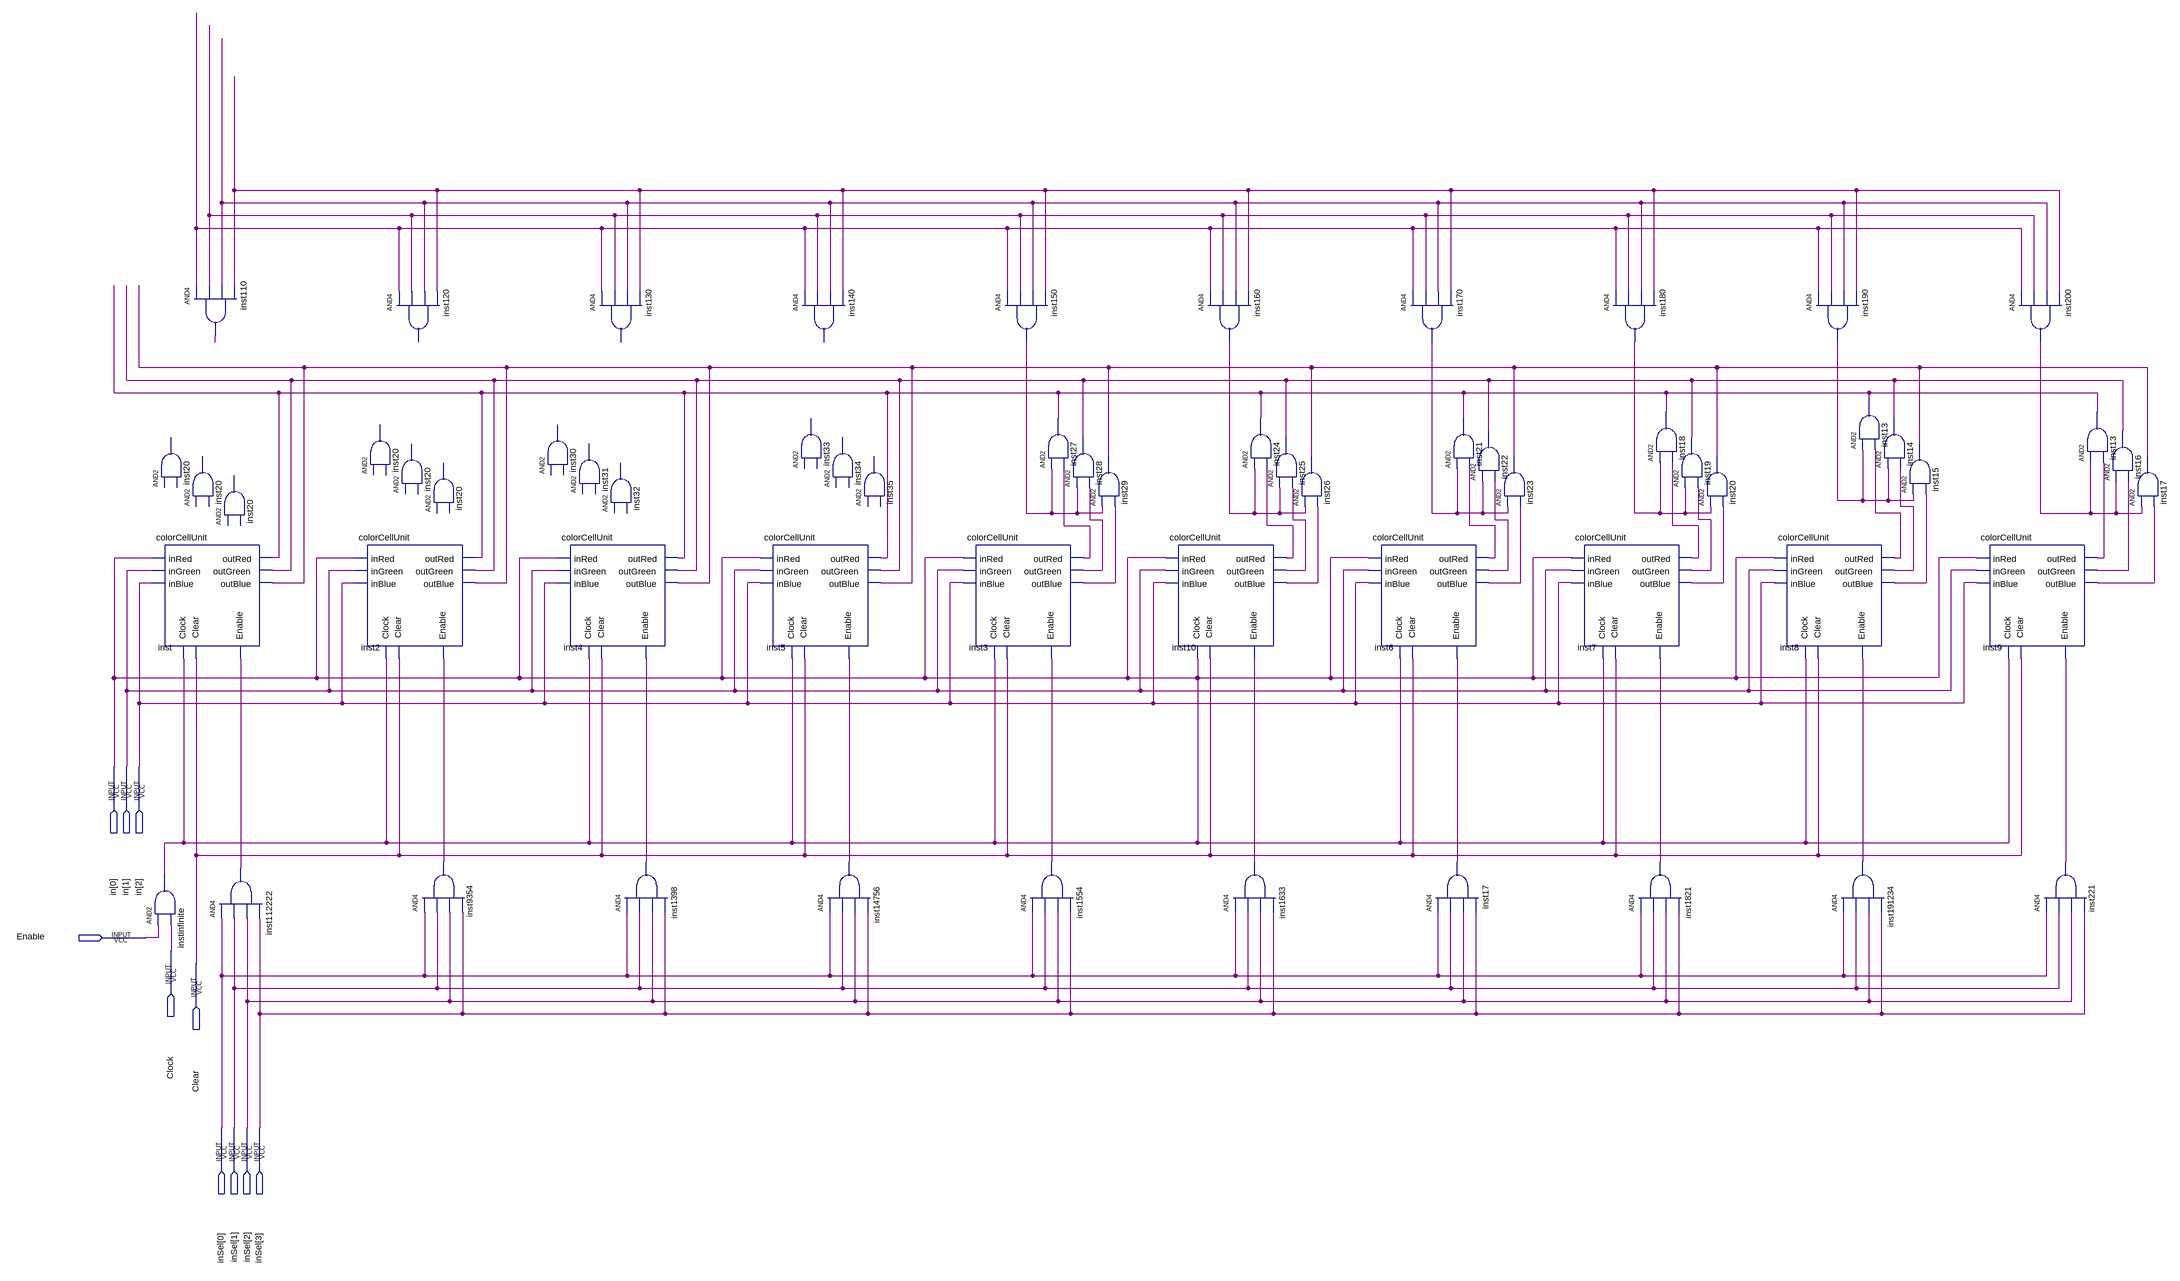
[diagram p0: schematic sheet]
// Quartus schematic colorCellRow.bdf as structural Verilog: 61 symbols, 10 pins
module colorCellRow (
  input  [2:0] in,
  input  Enable,
  input  Clock,
  input  Clear,
  input  [3:0] inSel
);

  wire inst3_outblue, inst3_outgreen, inst3_outred, inst6_outblue, inst6_outgreen, inst6_outred,
       inst7_outblue, inst7_outgreen, inst7_outred, inst8_outblue, inst8_outgreen, inst8_outred,
       inst9_outblue, inst9_outgreen, inst9_outred, inst10_outblue, inst10_outgreen, inst10_outred,
       inst17_out, inst110_out, inst150_out, inst160_out, inst170_out, inst180_out, inst190_out, inst200_out,
       inst221_out, inst1398_out, inst1554_out, inst1633_out, inst1821_out, inst9354_out, inst14756_out,
       inst112222_out, inst191234_out, inst_outblue, inst_outgreen, inst_outred, undriven, undriven_2,
       undriven_3, undriven_4;

  // AND2 inst20 is placed but not wired
  colorCellUnit inst (
    .inRed(in[0]), .inGreen(in[1]), .inBlue(in[2]), .Clock(in[0]), .Clear(Clear), .Enable(inst112222_out),
    .outRed(inst_outred), .outGreen(inst_outgreen), .outBlue(inst_outblue));
  and instinfinite (in[0], Enable, Clock);
  and inst110 (inst110_out, undriven_4, undriven, undriven_3, undriven_2);
  // AND2 inst20 is placed but not wired
  // AND2 inst20 is placed but not wired
  and inst112222 (inst112222_out, inSel[0], inSel[1], inSel[2], inSel[3]);
  // AND2 inst20 is placed but not wired
  colorCellUnit inst2 (
    .inRed(in[0]), .inGreen(in[1]), .inBlue(in[2]), .Clock(in[0]), .Clear(Clear), .Enable(inst9354_out),
    .outRed(inst_outred), .outGreen(inst_outgreen), .outBlue(inst_outblue));
  // AND4 inst120 has open pins: IN1=undriven_4, IN2=undriven, IN3=undriven_3, IN4=undriven_2, OUT=open
  // AND2 inst20 is placed but not wired
  and inst9354 (inst9354_out, inSel[0], inSel[1], inSel[2], inSel[3]);
  // AND2 inst20 is placed but not wired
  // AND2 inst30 is placed but not wired
  // AND2 inst31 is placed but not wired
  colorCellUnit inst4 (
    .inRed(in[0]), .inGreen(in[1]), .inBlue(in[2]), .Clock(in[0]), .Clear(Clear), .Enable(inst1398_out),
    .outRed(inst_outred), .outGreen(inst_outgreen), .outBlue(inst_outblue));
  // AND4 inst130 has open pins: IN1=undriven_4, IN2=undriven, IN3=undriven_3, IN4=undriven_2, OUT=open
  // AND2 inst32 is placed but not wired
  and inst1398 (inst1398_out, inSel[0], inSel[1], inSel[2], inSel[3]);
  colorCellUnit inst5 (
    .inRed(in[0]), .inGreen(in[1]), .inBlue(in[2]), .Clock(in[0]), .Clear(Clear), .Enable(inst14756_out),
    .outRed(inst_outred), .outGreen(inst_outgreen), .outBlue(inst_outblue));
  // AND4 inst140 has open pins: IN1=undriven_4, IN2=undriven, IN3=undriven_3, IN4=undriven_2, OUT=open
  // AND2 inst33 is placed but not wired
  // AND2 inst34 is placed but not wired
  and inst14756 (inst14756_out, inSel[0], inSel[1], inSel[2], inSel[3]);
  // AND2 inst35 is placed but not wired
  colorCellUnit inst3 (
    .inRed(in[0]), .inGreen(in[1]), .inBlue(in[2]), .Clock(in[0]), .Clear(Clear), .Enable(inst1554_out),
    .outRed(inst3_outred), .outGreen(inst3_outgreen), .outBlue(inst3_outblue));
  and inst150 (inst150_out, undriven_4, undriven, undriven_3, undriven_2);
  and inst1554 (inst1554_out, inSel[0], inSel[1], inSel[2], inSel[3]);
  and inst27 (inst_outred, inst150_out, inst3_outred);
  and inst28 (inst_outgreen, inst150_out, inst3_outgreen);
  and inst29 (inst_outblue, inst150_out, inst3_outblue);
  colorCellUnit inst10 (
    .inRed(in[0]), .inGreen(in[1]), .inBlue(in[2]), .Clock(in[0]), .Clear(Clear), .Enable(inst1633_out),
    .outRed(inst10_outred), .outGreen(inst10_outgreen), .outBlue(inst10_outblue));
  and inst160 (inst160_out, undriven_4, undriven, undriven_3, undriven_2);
  and inst1633 (inst1633_out, inSel[0], inSel[1], inSel[2], inSel[3]);
  and inst24 (inst_outred, inst160_out, inst10_outred);
  and inst25 (inst_outgreen, inst160_out, inst10_outgreen);
  and inst26 (inst_outblue, inst160_out, inst10_outblue);
  colorCellUnit inst6 (
    .inRed(in[0]), .inGreen(in[1]), .inBlue(in[2]), .Clock(in[0]), .Clear(Clear), .Enable(inst17_out),
    .outRed(inst6_outred), .outGreen(inst6_outgreen), .outBlue(inst6_outblue));
  and inst170 (inst170_out, undriven_4, undriven, undriven_3, undriven_2);
  and inst17 (inst17_out, inSel[0], inSel[1], inSel[2], inSel[3]);
  and inst21 (inst_outred, inst170_out, inst6_outred);
  and inst22 (inst_outgreen, inst170_out, inst6_outgreen);
  and inst23 (inst_outblue, inst170_out, inst6_outblue);
  colorCellUnit inst7 (
    .inRed(in[0]), .inGreen(in[1]), .inBlue(in[2]), .Clock(in[0]), .Clear(Clear), .Enable(inst1821_out),
    .outRed(inst7_outred), .outGreen(inst7_outgreen), .outBlue(inst7_outblue));
  and inst180 (inst180_out, undriven_4, undriven, undriven_3, undriven_2);
  and inst1821 (inst1821_out, inSel[0], inSel[1], inSel[2], inSel[3]);
  and inst18 (inst_outred, inst180_out, inst7_outred);
  and inst19 (inst_outgreen, inst180_out, inst7_outgreen);
  and inst20_dup7 (inst_outblue, inst180_out, inst7_outblue);
  colorCellUnit inst8 (
    .inRed(in[0]), .inGreen(in[1]), .inBlue(in[2]), .Clock(in[0]), .Clear(Clear), .Enable(inst191234_out),
    .outRed(inst8_outred), .outGreen(inst8_outgreen), .outBlue(inst8_outblue));
  and inst190 (inst190_out, undriven_4, undriven, undriven_3, undriven_2);
  and inst191234 (inst191234_out, inSel[0], inSel[1], inSel[2], inSel[3]);
  and inst13 (inst_outred, inst190_out, inst8_outred);
  and inst14 (inst_outgreen, inst190_out, inst8_outgreen);
  and inst15 (inst_outblue, inst190_out, inst8_outblue);
  colorCellUnit inst9 (
    .inRed(in[0]), .inGreen(in[1]), .inBlue(in[2]), .Clock(in[0]), .Clear(Clear), .Enable(inst221_out),
    .outRed(inst9_outred), .outGreen(inst9_outgreen), .outBlue(inst9_outblue));
  and inst200 (inst200_out, undriven_4, undriven, undriven_3, undriven_2);
  and inst221 (inst221_out, inSel[0], inSel[1], inSel[2], inSel[3]);
  and inst13_dup2 (inst_outred, inst200_out, inst9_outred);
  and inst16 (inst_outgreen, inst200_out, inst9_outgreen);
  and inst17_dup2 (inst_outblue, inst200_out, inst9_outblue);
endmodule
